# EAGLE design beagle_cnc_1.0 (EAGLE 7.3.0)
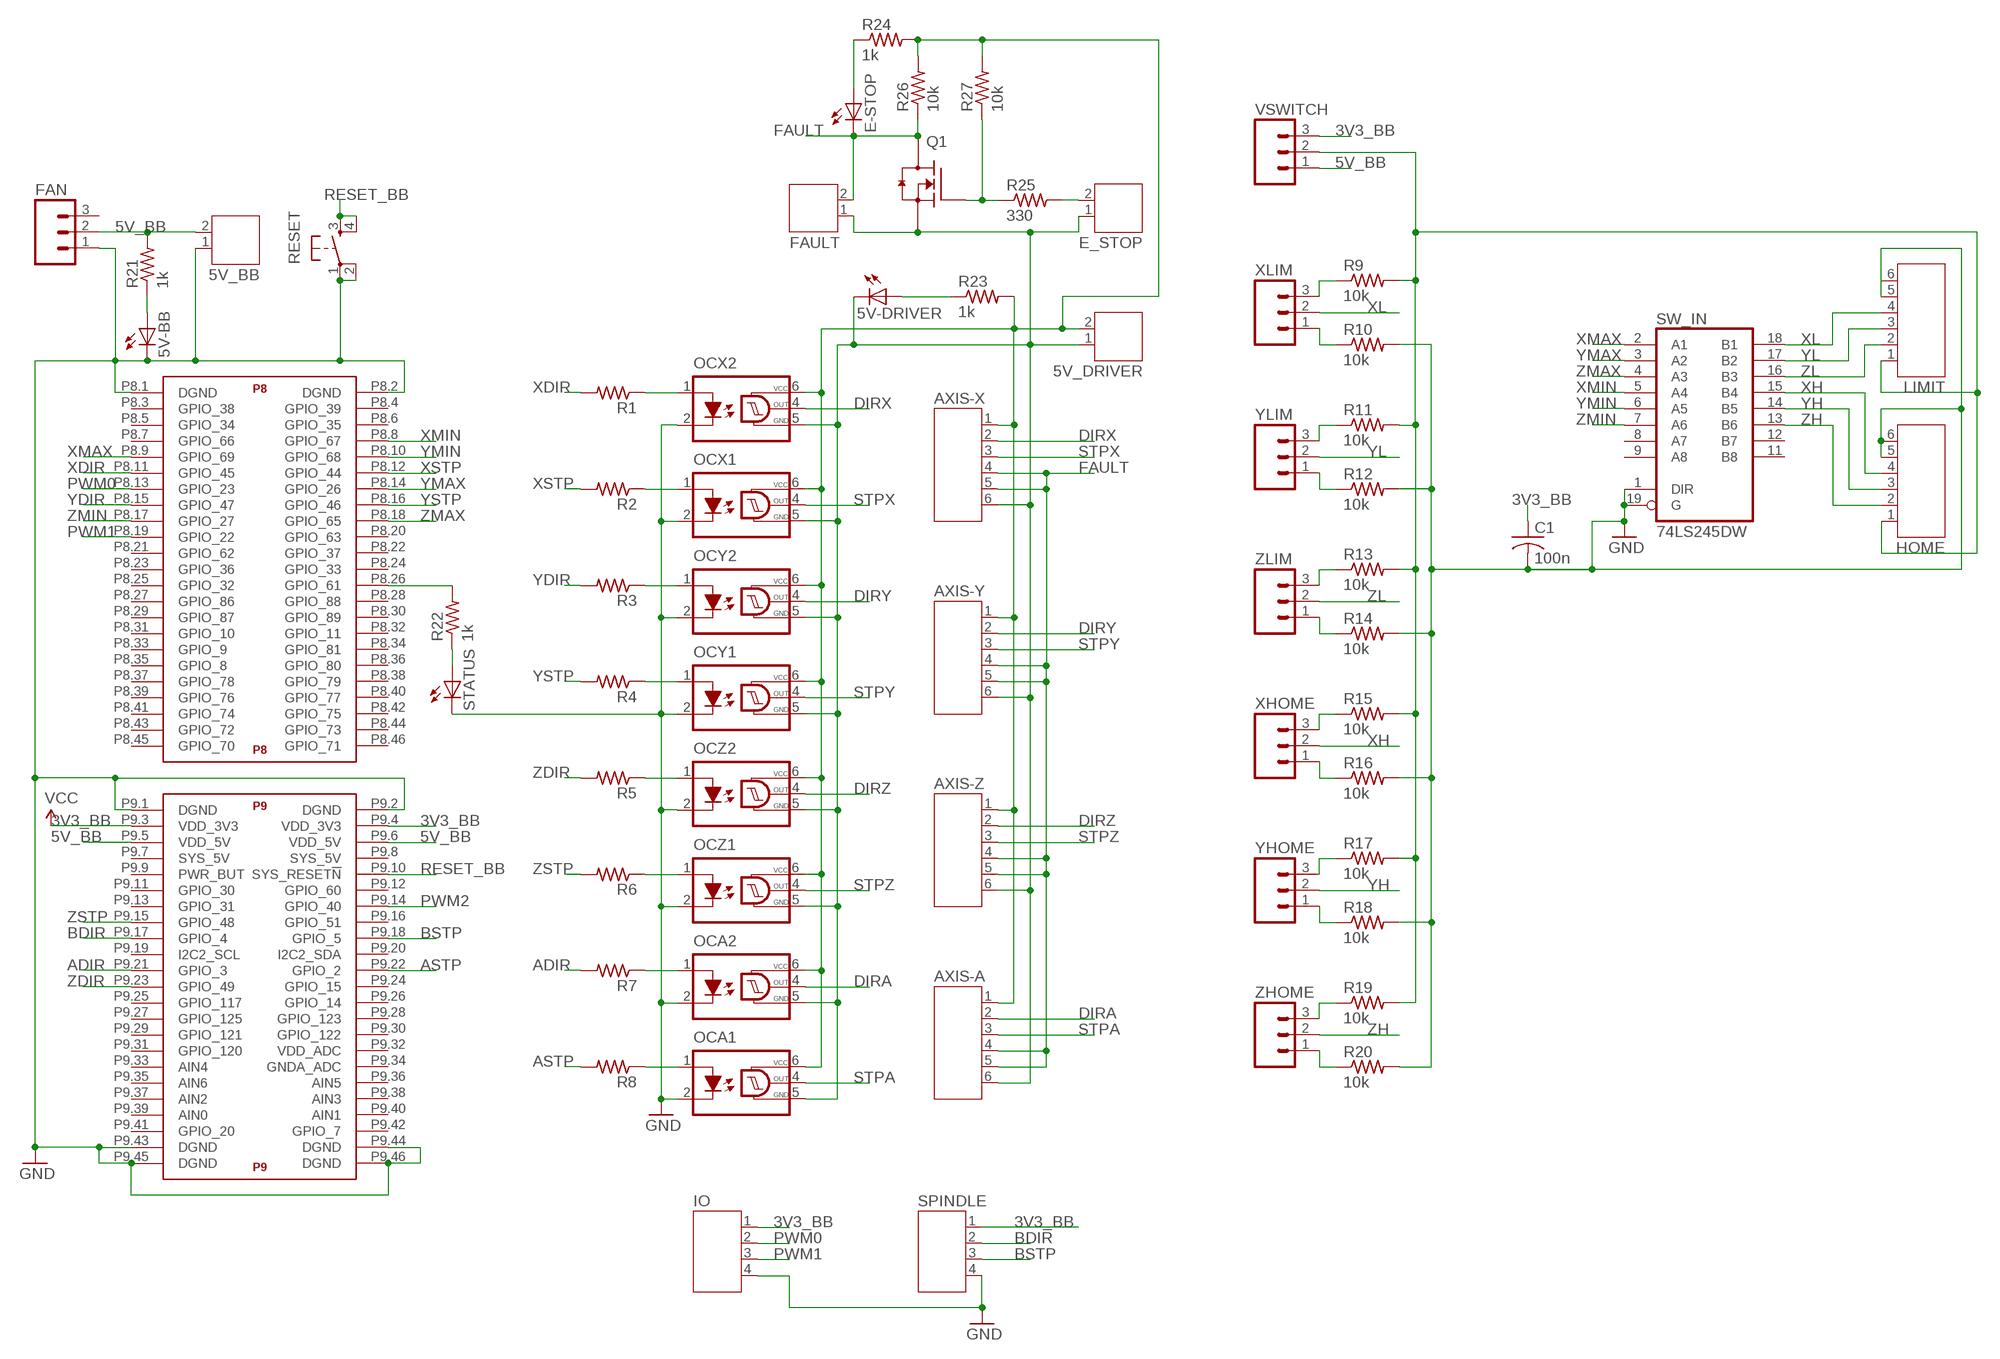
[diagram p0: schematic, sheet 1]

## Parts
5V-BB  LEDCHIP-LED0603  [CHIP-LED0603]
5V-DRIVER  LEDCHIP-LED0603  [CHIP-LED0603]
5V_BB  JST-PH2  [JST-PH2]
5V_DRIVER  JST-PH2  [JST-PH2]
AXIS-A  JST-PH6  [JST-PH6]
AXIS-X  JST-PH6  [JST-PH6]
AXIS-Y  JST-PH6  [JST-PH6]
AXIS-Z  JST-PH6  [JST-PH6]
C1  100n  C-USC0603  [C0603]
E-STOP  LEDCHIP-LED0603  [CHIP-LED0603]
E_STOP  JST-PH2  [JST-PH2]
FAN  M03POLAR  [MOLEX-1X3]
FAULT  JST-PH2  [JST-PH2]
HOME  JST-PH6  [JST-PH6]
IO  JST-PH4  [JST-PH4]
LIMIT  JST-PH6  [JST-PH6]
OCA1  H11L1MS  [DIL6-SMD]
OCA2  H11L1MS  [DIL6-SMD]
OCX1  H11L1MS  [DIL6-SMD]
OCX2  H11L1MS  [DIL6-SMD]
OCY1  H11L1MS  [DIL6-SMD]
OCY2  H11L1MS  [DIL6-SMD]
OCZ1  H11L1MS  [DIL6-SMD]
OCZ2  H11L1MS  [DIL6-SMD]
Q1  MOSFET-NCH_SOT-23  [SOT95P280X135-3N]
R1  R-US_R0603  [R0603]
R2  R-US_R0603  [R0603]
R3  R-US_R0603  [R0603]
R4  R-US_R0603  [R0603]
R5  R-US_R0603  [R0603]
R6  R-US_R0603  [R0603]
R7  R-US_R0603  [R0603]
R8  R-US_R0603  [R0603]
R9  10k  R-US_R0603  [R0603]
R10  10k  R-US_R0603  [R0603]
R11  10k  R-US_R0603  [R0603]
R12  10k  R-US_R0603  [R0603]
R13  10k  R-US_R0603  [R0603]
R14  10k  R-US_R0603  [R0603]
R15  10k  R-US_R0603  [R0603]
R16  10k  R-US_R0603  [R0603]
R17  10k  R-US_R0603  [R0603]
R18  10k  R-US_R0603  [R0603]
R19  10k  R-US_R0603  [R0603]
R20  10k  R-US_R0603  [R0603]
R21  1k  R-US_R0603  [R0603]
R22  1k  R-US_R0603  [R0603]
R23  1k  R-US_R0603  [R0603]
R24  1k  R-US_R0603  [R0603]
R25  330  R-US_R0603  [R0603]
R26  10k  R-US_R0603  [R0603]
R27  10k  R-US_R0603  [R0603]
RESET  TAC_SWITCHSMD  [TACTILE-SWITCH-SMD]
SPINDLE  JST-PH4  [JST-PH4]
STATUS  LEDCHIP-LED0603  [CHIP-LED0603]
SW_IN  74LS245DW  [SO20W]
U$1  BEAGLE_BONE_BLACK_CAPE  [BEAGLE_BONE_BLACK_CAPE]
VSWITCH  M03PTH  [1X03]
XHOME  M03PTH  [1X03]
XLIM  M03PTH  [1X03]
YHOME  M03PTH  [1X03]
YLIM  M03PTH  [1X03]
ZHOME  M03PTH  [1X03]
ZLIM  M03PTH  [1X03]

## Nets
3V3_BB: C1.1 IO.1 SPINDLE.1 U$1.P9.3(P9:VDD_3V3) U$1.P9.4(P9:VDD_3V3) VSWITCH.3 ; supply symbol labelled VCC
5V_BB: 5V_BB.2 FAN.2 R21.2 U$1.P9.5(P9:VDD_5V) U$1.P9.6(P9:VDD_5V) VSWITCH.1
ADIR: R7.2 U$1.P9.21(P9:GPIO_3)
ASTP: R8.2 U$1.P9.22(P9:GPIO_2)
AXISGND: 5V-DRIVER.C 5V_DRIVER.1 AXIS-A.6 AXIS-X.6 AXIS-Y.6 AXIS-Z.6 E_STOP.1 FAULT.1 OCA1.5(GND) OCA2.5(GND) OCX1.5(GND) OCX2.5(GND) OCY1.5(GND) OCY2.5(GND) OCZ1.5(GND) OCZ2.5(GND) Q1.2(S)
BDIR: SPINDLE.2 U$1.P9.17(P9:GPIO_4)
BLABLA: HOME.1 LIMIT.1 R9.2 R11.2 R13.2 R15.2 R17.2 R19.2 VSWITCH.2
BSTP: SPINDLE.3 U$1.P9.18(P9:GPIO_5)
DIRA: AXIS-A.2 OCA2.4(OUT)
DIRX: AXIS-X.2 OCX2.4(OUT)
DIRY: AXIS-Y.2 OCY2.4(OUT)
DIRZ: AXIS-Z.2 OCZ2.4(OUT)
FAULT: AXIS-A.4 AXIS-A.5 AXIS-X.4 AXIS-X.5 AXIS-Y.4 AXIS-Y.5 AXIS-Z.4 AXIS-Z.5 E-STOP.C FAULT.2 Q1.3(D) R26.1
GND: 5V-BB.C 5V_BB.1 C1.2 FAN.1 HOME.5 HOME.6 IO.4 LIMIT.5 LIMIT.6 OCA1.2(C) OCA2.2(C) OCX1.2(C) OCX2.2(C) OCY1.2(C) OCY2.2(C) OCZ1.2(C) OCZ2.2(C) R10.2 R12.2 R14.2 R16.2 R18.2 R20.2 RESET.1 RESET.2 SPINDLE.4 STATUS.C SW_IN.1(DIR) SW_IN.19(G) U$1.P8.1(P8:DGND) U$1.P8.2(P8:DGND) U$1.P9.1(P9:DGND) U$1.P9.2(P9:DGND) U$1.P9.43(P9:DGND) U$1.P9.44(P9:DGND) U$1.P9.45(P9:DGND) U$1.P9.46(P9:DGND)
N$1: 5V-BB.A R21.1
N$2: OCA1.1(A) R8.1
N$3: 5V-DRIVER.A R23.1
N$4: R22.1 STATUS.A
N$6: OCA2.1(A) R7.1
N$8: OCZ1.1(A) R6.1
N$9: R9.1 XLIM.3
N$10: OCZ2.1(A) R5.1
N$11: E-STOP.A R24.1
N$12: OCY1.1(A) R4.1
N$14: OCY2.1(A) R3.1
N$16: OCX1.1(A) R2.1
N$17: OCX2.1(A) R1.1
N$18: R10.1 XLIM.1
N$19: R11.1 YLIM.3
N$24: R12.1 YLIM.1
N$25: R13.1 ZLIM.3
N$26: R14.1 ZLIM.1
N$27: R15.1 XHOME.3
N$28: R16.1 XHOME.1
N$29: R17.1 YHOME.3
N$30: R18.1 YHOME.1
N$31: R19.1 ZHOME.3
N$32: R20.1 ZHOME.1
N$33: Q1.1(G) R25.1 R27.1
N$34: E_STOP.2 R25.2
N$37: 5V_DRIVER.2 AXIS-A.1 AXIS-X.1 AXIS-Y.1 AXIS-Z.1 OCA1.6(VCC) OCA2.6(VCC) OCX1.6(VCC) OCX2.6(VCC) OCY1.6(VCC) OCY2.6(VCC) OCZ1.6(VCC) OCZ2.6(VCC) R23.2 R24.2 R26.2 R27.2
PWM0: IO.2 U$1.P8.13(P8:GPIO_23)
PWM1: IO.3 U$1.P8.19(P8:GPIO_22)
PWM2: U$1.P9.14(P9:GPIO_40)
RESET_BB: RESET.3 RESET.4 U$1.P9.10(P9:SYS_RESET!N)
STATUS: R22.2 U$1.P8.26(P8:GPIO_61)
STPA: AXIS-A.3 OCA1.4(OUT)
STPX: AXIS-X.3 OCX1.4(OUT)
STPY: AXIS-Y.3 OCY1.4(OUT)
STPZ: AXIS-Z.3 OCZ1.4(OUT)
XDIR: R1.2 U$1.P8.11(P8:GPIO_45)
XH: HOME.4 SW_IN.15(B4) XHOME.2
XL: LIMIT.4 SW_IN.18(B1) XLIM.2
XMAX: SW_IN.2(A1) U$1.P8.9(P8:GPIO_69)
XMIN: SW_IN.5(A4) U$1.P8.8(P8:GPIO_67)
XSTP: R2.2 U$1.P8.12(P8:GPIO_44)
YDIR: R3.2 U$1.P8.15(P8:GPIO_47)
YH: HOME.3 SW_IN.14(B5) YHOME.2
YL: LIMIT.3 SW_IN.17(B2) YLIM.2
YMAX: SW_IN.3(A2) U$1.P8.14(P8:GPIO_26)
YMIN: SW_IN.6(A5) U$1.P8.10(P8:GPIO_68)
YSTP: R4.2 U$1.P8.16(P8:GPIO_46)
ZDIR: R5.2 U$1.P9.23(P9:GPIO_49)
ZH: HOME.2 SW_IN.13(B6) ZHOME.2
ZL: LIMIT.2 SW_IN.16(B3) ZLIM.2
ZMAX: SW_IN.4(A3) U$1.P8.18(P8:GPIO_65)
ZMIN: SW_IN.7(A6) U$1.P8.17(P8:GPIO_27)
ZSTP: R6.2 U$1.P9.15(P9:GPIO_48)
Unconnected: FAN.3 SW_IN.8(A7) SW_IN.9(A8) SW_IN.11(B8) SW_IN.12(B7) U$1.P8.3(P8:GPIO_38) U$1.P8.4(P8:GPIO_39) U$1.P8.5(P8:GPIO_34) U$1.P8.6(P8:GPIO_35) U$1.P8.7(P8:GPIO_66) U$1.P8.20(P8:GPIO_63) U$1.P8.21(P8:GPIO_62) U$1.P8.22(P8:GPIO_37) U$1.P8.23(P8:GPIO_36) U$1.P8.24(P8:GPIO_33) U$1.P8.25(P8:GPIO_32) U$1.P8.27(P8:GPIO_86) U$1.P8.28(P8:GPIO_88) U$1.P8.29(P8:GPIO_87) U$1.P8.30(P8:GPIO_89) U$1.P8.31(P8:GPIO_10) U$1.P8.32(P8:GPIO_11) U$1.P8.33(P8:GPIO_9) U$1.P8.34(P8:GPIO_81) U$1.P8.35(P8:GPIO_8) U$1.P8.36(P8:GPIO_80) U$1.P8.37(P8:GPIO_78) U$1.P8.38(P8:GPIO_79) U$1.P8.39(P8:GPIO_76) U$1.P8.40(P8:GPIO_77) U$1.P8.41(P8:GPIO_74) U$1.P8.42(P8:GPIO_75) U$1.P8.43(P8:GPIO_72) U$1.P8.44(P8:GPIO_73) U$1.P8.45(P8:GPIO_70) U$1.P8.46(P8:GPIO_71) U$1.P9.7(P9:SYS_5V) U$1.P9.8(P9:SYS_5V) U$1.P9.9(P9:PWR_BUT) U$1.P9.11(P9:GPIO_30) U$1.P9.12(P9:GPIO_60) U$1.P9.13(P9:GPIO_31) U$1.P9.16(P9:GPIO_51) U$1.P9.19(P9:I2C2_SCL) U$1.P9.20(P9:I2C2_SDA) U$1.P9.24(P9:GPIO_15) U$1.P9.25(P9:GPIO_117) U$1.P9.26(P9:GPIO_14) U$1.P9.27(P9:GPIO_125) U$1.P9.28(P9:GPIO_123) U$1.P9.29(P9:GPIO_121) U$1.P9.30(P9:GPIO_122) U$1.P9.31(P9:GPIO_120) U$1.P9.32(P9:VDD_ADC) U$1.P9.33(P9:AIN4) U$1.P9.34(P9:GNDA_ADC) U$1.P9.35(P9:AIN6) U$1.P9.36(P9:AIN5) U$1.P9.37(P9:AIN2) U$1.P9.38(P9:AIN3) U$1.P9.39(P9:AIN0) U$1.P9.40(P9:AIN1) U$1.P9.41(P9:GPIO_20) U$1.P9.42(P9:GPIO_7)

## Power pins joined to a net without a drawn wire
3V3_BB: SW_IN.20(VCC)
GND: SW_IN.10(GND)

## Library data of the parts
5V-BB 5V-DRIVER E-STOP STATUS = adafruit:LED: LED OSRAM: - CHIPLED LG R971, LG N971, LY N971, LG Q971, LY Q971, LO R971, LY R971 LH N974, LH R974 LS Q976, LO Q976, LY Q976 LO Q996 - Hyper CHIPLED LW Q18S LB Q993, LB Q99A, LB R99A - SideLED LS A670, LO A670, LY A670, LG A670, LP A670 LB A673, LV A673, LT A673, LW A673 LH A674 LY A675 LS A676, LA A676, LO A676, LY A676, LW A676 LS A679, LY A679, LG A679 - Hyper Micro SIDELED® LS Y876, LA Y876, LO Y876, LY Y876 LT Y87S - SmartLED LW L88C, LW L88S LB L89C, LB L89S, LG L890 LS L89K, LO L89K, LY L89K LS L896, LA L896, LO L896, LY L896 - TOPLED LS T670, LO T670, LY T670, LG T670, LP T670 LSG T670, LSP T670, LSY T670, LOP T670, LYG T670 LG T671, LOG T671, LSG T671 LB T673, LV T673, LT T673, LW T673 LH T674 LS T676, LA T676, LO T676, LY T676, LB T676, LH T676, LSB T676, LW T676 LB T67C, LV T67C, LT T67C, LS T67K, LO T67K, LY T67K, LW E67C LS E67B, LA E67B, LO E67B, LY E67B, LB E67C, LV E67C, LT E67C LW T67C LS T679, LY T679, LG T679 LS T770, LO T770, LY T770, LG T770, LP T770 LB T773, LV T773, LT T773, LW T773 LH T774 LS E675, LA E675, LY E675, LS T675 LS T776, LA T776, LO T776, LY T776, LB T776 LHGB T686 LT T68C, LB T68C - Hyper Mini TOPLED® LB M676 - Mini TOPLED Santana® LG M470 LS M47K, LO M47K, LY M47K Source: http://www.osram.convergy.de/
5V_BB 5V_DRIVER E_STOP FAULT = jst-ph:JST-PH2
AXIS-A AXIS-X AXIS-Y AXIS-Z HOME LIMIT = jst-ph:JST-PH6
C1 = adafruit:C-US: CAPACITOR, American symbol
FAN VSWITCH XHOME XLIM YHOME YLIM ZHOME ZLIM = SparkFun-Connectors:M03: Header 3 Standard 3-pin 0.1" header. Use with straight break away headers (SKU : PRT-00116), right angle break away headers (PRT-00553), swiss pins (PRT-00743), machine pins (PRT-00117), and female headers (PRT-00115). Molex polarized connector foot print use with SKU : PRT-08232 with associated crimp pins and housings.
IO SPINDLE = jst-ph:JST-PH4
OCA1 OCA2 OCX1 OCX2 OCY1 OCY2 OCZ1 OCZ2 = optocoupler:H11L*M: 6-Pin DIP Optocoupler Source: http://www.fairchildsemi.com/ds/H1/H11L2-M.pdf; OC_FARNELL: unknown; OC_NEWARK: unknown
Q1 = ipc-7351-transistor:MOSFET-NCH_
R1-R27 = adafruit:R-US_: RESISTOR, American symbol
RESET = SparkFun-Electromechanical:TAC_SWITCH: Momentary Switch Button commonly used for reset or general input. Spark Fun Electronics SKU : COM-00097 SMT- SWCH-08247; PROD_ID: SWCH-08247
SW_IN = adafruit:74*245: Octal BUS TRANSCEIVER, 3-state
U$1 = SparkFun-Boards:BEAGLE_BONE_BLACK_CAPE

## Board
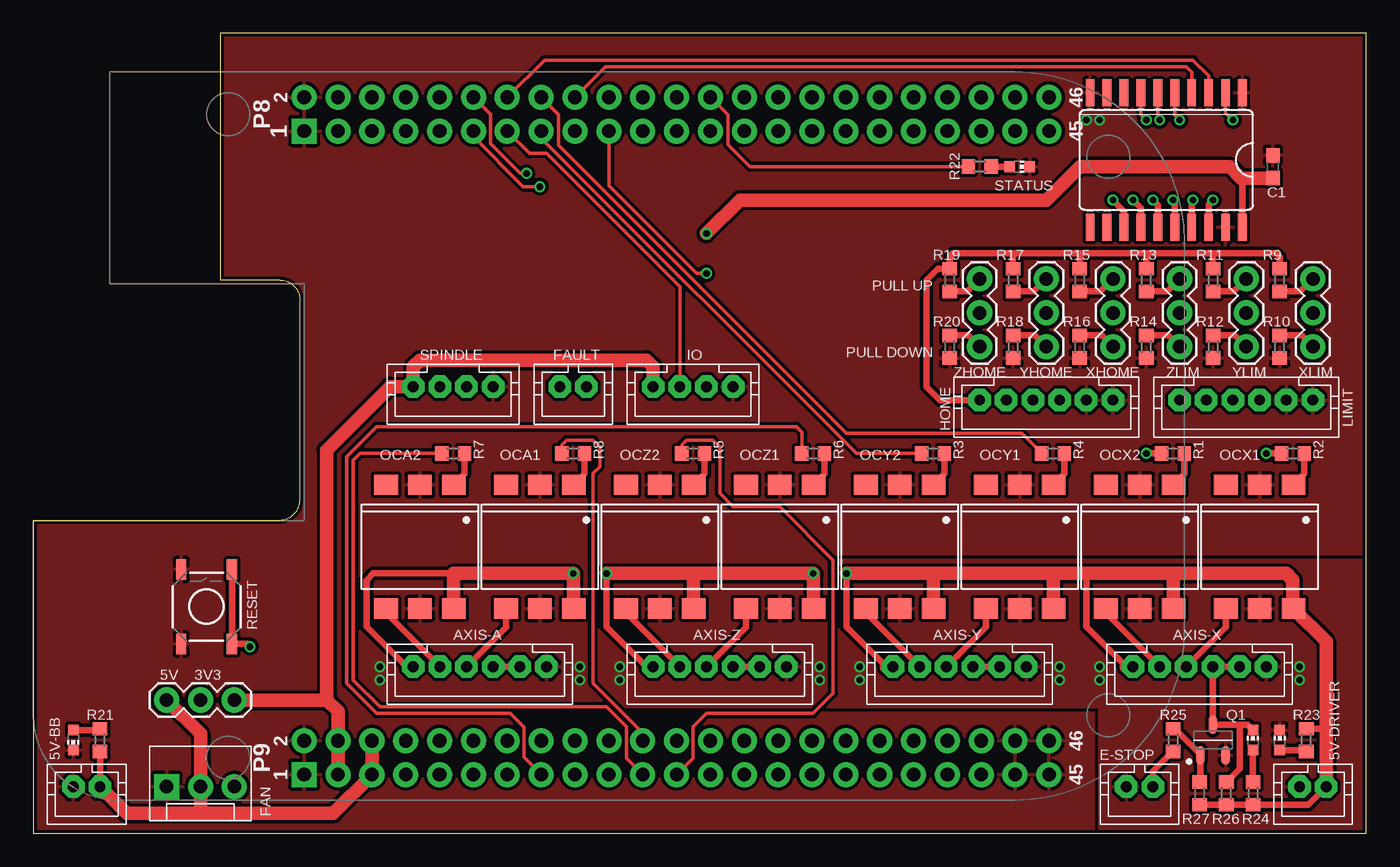
[diagram p1: board, top side]
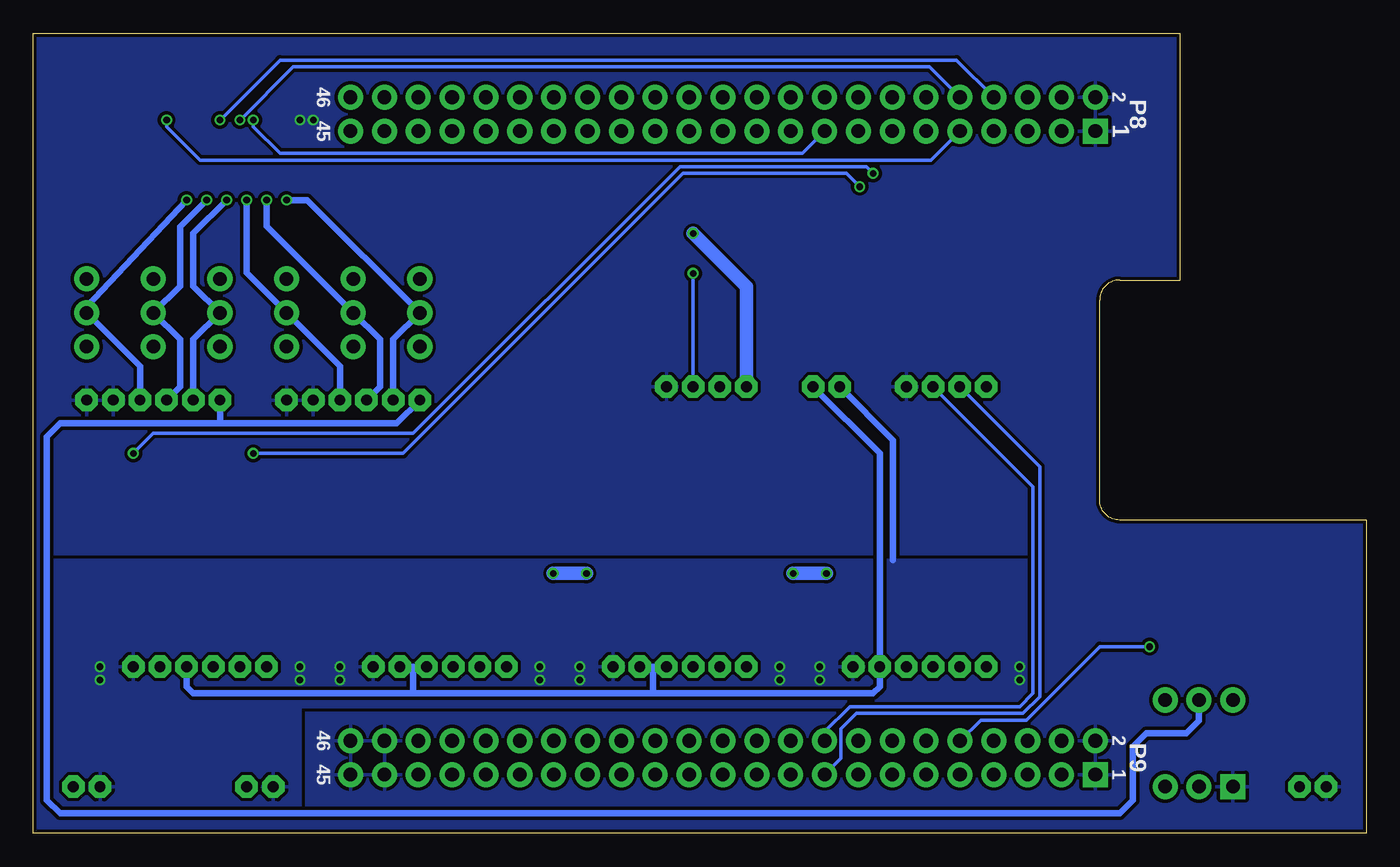
[diagram p2: board, bottom side, seen from below]

Size 100 x 60 mm. Coordinates in mm from the lower left corner, seen from the top.
Outline: 0,0 100,0 100,60 14,60 14,41.5 18.5,41.5 arc-90 20,40 20,25 arc-90 18.5,23.5 0,23.5 0,0
Copper layers (1*16): Top 0.035mm / dielectric 1.5mm / Bottom 0.035mm
Design rules "ITEADstudio_DRC": minimum track width 6mil, minimum drill 12mil, track to track 6mil, track to pad 6mil, pad to pad 6mil, via to via 6mil, smd to smd 0mil, copper to edge 10mil, drill to drill 10mil, minimum pad ring 10mil, minimum via ring 6mil, stop-mask expansion 2mil, vias tented up to drill 100mil, thermal gap 10mil

### Footprints (pad centres in the part's own frame; a part is rotated, then mirrored left to right if it is on the bottom)
CHIP-LED0603 = smd 0.8 x 0.8: A 0,-0.75; C 0,0.75
JST-PH2 = drill 0.813 pad 1.676 octagon: 1 1,0; 2 -1,0
JST-PH6 = drill 0.813 pad 1.676 octagon: 1 5,0; 2 3,0; 3 1,0; 4 -1,0; 5 -3,0; 6 -5,0
C0603 = smd 1.1 x 1: 1 -0.85,0; 2 0.85,0
MOLEX-1X3 = drill 1.016 pad 1.88 square: 1 0,0 | drill 1.016 pad 1.88: 2 2.54,0; 3 5.08,0
JST-PH4 = drill 0.813 pad 1.676 octagon: 1 3,0; 2 1,0; 3 -1,0; 4 -3,0
DIL6-SMD = smd 1.78 x 1.52: 1 -2.54,-4.645; 2 0,-4.645; 3 2.54,-4.645; 4 2.54,4.645; 5 0,4.645; 6 -2.54,4.645
SOT95P280X135-3N = smd 1.4 x 0.65: 1 -1.15,0.95; 2 -1.15,-0.95; 3 1.15,0
R0603 = smd 1 x 1.1: 1 -0.85,0; 2 0.85,0
TACTILE-SWITCH-SMD = smd 1.524 x 0.762: 1 -2.794,1.905; 2 2.794,1.905; 3 -2.794,-1.905; 4 2.794,-1.905
SO20W = smd 0.66 x 2.032: 1 -5.715,-5.029; 2 -4.445,-5.029; 3 -3.175,-5.029; 4 -1.905,-5.029; 5 -0.635,-5.029; 6 0.635,-5.029; 7 1.905,-5.029; 8 3.175,-5.029; 9 4.445,-5.029; 10 5.715,-5.029; 11 5.715,5.029; 12 4.445,5.029; 13 3.175,5.029; 14 1.905,5.029; 15 0.635,5.029; 16 -0.635,5.029; 17 -1.905,5.029; 18 -3.175,5.029; 19 -4.445,5.029; 20 -5.715,5.029
BEAGLE_BONE_BLACK_CAPE = drill 1.016 pad 1.88 square: P8.1 20.32,50.165; P9.1 20.32,1.905 | drill 1.016 pad 1.88: P8.2 20.32,52.705; P8.3 22.86,50.165; P8.4 22.86,52.705; P8.5 25.4,50.165; P8.6 25.4,52.705; P8.7 27.94,50.165; P8.8 27.94,52.705; P8.9 30.48,50.165; P8.10 30.48,52.705; P8.11 33.02,50.165; P8.12 33.02,52.705; P8.13 35.56,50.165; P8.14 35.56,52.705; P8.15 38.1,50.165; P8.16 38.1,52.705; P8.17 40.64,50.165; P8.18 40.64,52.705; P8.19 43.18,50.165; P8.20 43.18,52.705; P8.21 45.72,50.165; P8.22 45.72,52.705; P8.23 48.26,50.165; P8.24 48.26,52.705; P8.25 50.8,50.165; P8.26 50.8,52.705; P8.27 53.34,50.165; P8.28 53.34,52.705; P8.29 55.88,50.165; P8.30 55.88,52.705; P8.31 58.42,50.165; P8.32 58.42,52.705; P8.33 60.96,50.165; P8.34 60.96,52.705; P8.35 63.5,50.165; P8.36 63.5,52.705; P8.37 66.04,50.165; P8.38 66.04,52.705; P8.39 68.58,50.165; P8.40 68.58,52.705; P8.41 71.12,50.165; P8.42 71.12,52.705; P8.43 73.66,50.165; P8.44 73.66,52.705; P8.45 76.2,50.165; P8.46 76.2,52.705; P9.2 20.32,4.445; P9.3 22.86,1.905; P9.4 22.86,4.445; P9.5 25.4,1.905; P9.6 25.4,4.445; P9.7 27.94,1.905; P9.8 27.94,4.445; P9.9 30.48,1.905; P9.10 30.48,4.445; P9.11 33.02,1.905; P9.12 33.02,4.445; P9.13 35.56,1.905; P9.14 35.56,4.445; P9.15 38.1,1.905; P9.16 38.1,4.445; P9.17 40.64,1.905; P9.18 40.64,4.445; P9.19 43.18,1.905; P9.20 43.18,4.445; P9.21 45.72,1.905; P9.22 45.72,4.445; P9.23 48.26,1.905; P9.24 48.26,4.445; P9.25 50.8,1.905; P9.26 50.8,4.445; P9.27 53.34,1.905; P9.28 53.34,4.445; P9.29 55.88,1.905; P9.30 55.88,4.445; P9.31 58.42,1.905; P9.32 58.42,4.445; P9.33 60.96,1.905; P9.34 60.96,4.445; P9.35 63.5,1.905; P9.36 63.5,4.445; P9.37 66.04,1.905; P9.38 66.04,4.445; P9.39 68.58,1.905; P9.40 68.58,4.445; P9.41 71.12,1.905; P9.42 71.12,4.445; P9.43 73.66,1.905; P9.44 73.66,4.445; P9.45 76.2,1.905; P9.46 76.2,4.445
1X03 = drill 1.016 pad 1.88: 1 0,0; 2 2.54,0; 3 5.08,0

### Placement (x,y rotation side)
5V-BB  3,7 180 top
5V-DRIVER  93.5,7 0 top
5V_BB  4,3.5 180 top
5V_DRIVER  96,3.5 180 top
AXIS-A  33.5,12.5 180 top
AXIS-X  87.5,12.5 180 top
AXIS-Y  69.5,12.5 180 top
AXIS-Z  51.5,12.5 180 top
C1  93,50 90 top
E-STOP  91.5,7 0 top
E_STOP  83,3.5 180 top
FAN  10,3.5 0 top
FAULT  40.5,33.5 180 top
HOME  76,32.5 180 top
IO  49.5,33.5 180 top
LIMIT  91,32.5 180 top
OCA1  38,21.5 180 top
OCA2  29,21.5 180 top
OCX1  92,21.5 180 top
OCX2  83,21.5 180 top
OCY1  74,21.5 180 top
OCY2  65,21.5 180 top
OCZ1  56,21.5 180 top
OCZ2  47,21.5 180 top
Q1  88.5,7 90 top
R1  85.5,28.5 180 top
R2  94.5,28.5 180 top
R3  67.5,28.5 180 top
R4  76.5,28.5 180 top
R5  49.5,28.5 180 top
R6  58.5,28.5 180 top
R7  31.5,28.5 180 top
R8  40.5,28.5 180 top
R9  93.5,41.5 90 top
R10  93.5,36.5 270 top
R11  88.5,41.5 90 top
R12  88.5,36.5 270 top
R13  83.5,41.5 90 top
R14  83.5,36.5 270 top
R15  78.5,41.5 90 top
R16  78.5,36.5 270 top
R17  73.5,41.5 90 top
R18  73.5,36.5 270 top
R19  68.75,41.5 90 top
R20  68.75,36.5 270 top
R21  5,7 270 top
R22  71,50 180 top
R23  95.5,7 90 top
R24  91.5,3 270 top
R25  85.5,7 270 top
R26  89.5,3 270 top
R27  87.5,3 270 top
RESET  13,17 90 top
SPINDLE  31.5,33.5 180 top
STATUS  74,50 270 top
SW_IN  85,50.5 180 top
U$1  0,2.5 0 top
VSWITCH  10,10 0 top
XHOME  81,36.5 90 top
XLIM  96,36.5 90 top
YHOME  76,36.5 90 top
YLIM  91,36.5 90 top
ZHOME  71,36.5 90 top
ZLIM  86,36.5 90 top

### Tracks (layer width: path | path; a pad name or v marks a point on that pad's centre or on a via)
3V3_BB  (via drill 0.5)
  Top 0.5: SW_IN.20 90.72,48.94 90.75,49.15 | 31.54,35.5 32,35.5
  Top 1: U$1.P9.3 U$1.P9.4 22.86,9.14 22,10 | VSWITCH.3 22,10 | v50.5,45 53,47.5 76,47.5 78.5,50 89.75,50 90.6,49.15 90.75,49.15 C1.1 | 22,10 22,28.75 26.75,33.5 SPINDLE.1 28.5,35 29,35.5 32,35.5 46,35.5 46.5,35 IO.1
  Bottom 1: IO.1 46.5,41 v50.5,45
5V_BB
  Top 0.5: 5V_BB.2 R21.2
  Top 1: U$1.P9.6 U$1.P9.5 22.5,1.5 12.54,1.5 | 5V_BB.2 7,1.5 12.54,1.5 | 12.54,1.5 FAN.2 12.54,7.46 VSWITCH.1
  Bottom 0.5: U$1.P9.5
ADIR
  Top 0.25: R7.2 24.5,28.5 24,28 24,11.5 26,9.5 43,9.5 44.5,8 44.5,5.62 U$1.P9.21
ASTP
  Top 0.25: U$1.P9.22 45.72,7.53 42,11.25 42,27 42.5,27.5 42.5,29 42,29.5 40,29.5 39.65,29.15 R8.2
AXISGND  (via drill 0.5)
  Bottom 0.5: FAULT.1 35.5,29.5 35.5,20.5
  other vias: 41,12.5 59,12.5 77,12.5 95,12.5 26,12.5 44,12.5 62,12.5 80,12.5 41,11.5 26,11.5 44,11.5 59,11.5 62,11.5 77,11.5 80,11.5 95,11.5
  pour Bottom (isolate 0.25): 100,0 100,20.5 24.5,20.5 24.5,9.5 80,9.5 80,0
  pour Top (isolate 0.25): 100,0 100,20.5 24.5,20.5 24.5,9.5 80,9.5 80,0
BDIR
  Bottom 0.25: U$1.P9.17 39.4,5.64 39.4,7.85 38.25,9 25.75,9 24.5,10.25 24.5,27.5 SPINDLE.2
BLABLA
  Top 0.5: 73.5,43.5 69,43.5 68.75,43.25 R19.2 67.85,42.35 67,41.5 67,33.5 68,32.5 HOME.1 | 73.5,43.5 78.5,43.5 | 78.5,43.5 83.5,43.5 | 83.5,43.5 88.5,43.5 | 88.5,43.5 93.25,43.5 93.5,43.25 R9.2 | R11.2 88.5,43.5 | R13.2 83.5,43.5 | R15.2 78.5,43.5 | R17.2 73.5,43.5
  Bottom 0.5: HOME.1 72.75,30.75 86,30.75 | VSWITCH.2 12.54,8.46 13.5,7.5 16.5,7.5 17.5,6.5 17.5,2.5 18.5,1.5 98,1.5 99,2.5 99,29.75 98,30.75 86,30.75 | 86,30.75 LIMIT.1
BSTP
  Bottom 0.25: U$1.P9.18 40.64,7.61 38.75,9.5 26,9.5 25,10.5 25,26 SPINDLE.3
DIRA
  Top 0.5: OCA2.4 26.46,16.54 AXIS-A.2
DIRX
  Top 0.5: OCX2.4 80.46,16.54 AXIS-X.2
DIRY
  Top 0.5: OCY2.4 62.46,16.54 AXIS-Y.2
DIRZ
  Top 0.5: OCZ2.4 44.46,16.54 AXIS-Z.2
FAULT
  Top 0.5: AXIS-A.4 AXIS-A.5 | AXIS-Z.4 AXIS-Z.5 | AXIS-Y.4 AXIS-Y.5 | AXIS-X.5 AXIS-X.4 Q1.3 90.5,8.15 | 90.5,8.15 91.1,8.15 E-STOP.C | R26.1 90.5,4.85 90.5,8.15
  Bottom 0.5: 53.5,10.5 37,10.5 36.5,11 AXIS-A.5 36.5,28.5 FAULT.2 | 53.5,10.5 71.5,10.5 | 71.5,10.5 88,10.5 88.5,11 AXIS-X.4 | AXIS-Z.4 53.5,12.5 53.5,10.5 | AXIS-Y.5 71.5,12.5 71.5,10.5
GND  (via drill 0.5)
  other vias: 79,53.5 80,53.5
  pour Top (isolate 0.25, rank 6): 0,0 100,0 100,60 0,60
  pour Bottom (isolate 0.25, rank 6): 0,0 100,0 100,60 0,60
N$1
  Top 0.5: R21.1 4.9,7.75 5V-BB.A
N$2
  Top 0.5: OCA1.1 41.35,26.95 R8.1
N$3
  Top 0.5: R23.1 95.4,6.25 5V-DRIVER.A
N$4
  Top 0.5: STATUS.A R22.1
N$6
  Top 0.5: OCA2.1 32.35,26.95 R7.1
N$8
  Top 0.5: OCZ1.1 59.35,26.95 R6.1
N$9
  Top 0.5: R9.1 95.07,40.65 XLIM.3
N$10
  Top 0.5: OCZ2.1 50.35,26.95 R5.1
N$11
  Top 0.5: R24.1 E-STOP.A
N$12
  Top 0.5: OCY1.1 77.35,26.95 R4.1
N$14
  Top 0.5: OCY2.1 68.35,26.95 R3.1
N$16
  Top 0.5: OCX1.1 95.35,26.95 R2.1
N$17
  Top 0.5: OCX2.1 86.35,26.95 R1.1
N$18
  Top 0.5: R10.1 95.15,37.35 XLIM.1
N$19
  Top 0.5: R11.1 90.07,40.65 YLIM.3
N$24
  Top 0.5: R12.1 90.15,37.35 YLIM.1
N$25
  Top 0.5: R13.1 85.07,40.65 ZLIM.3
N$26
  Top 0.5: R14.1 85.15,37.35 ZLIM.1
N$27
  Top 0.5: R15.1 80.07,40.65 XHOME.3
N$28
  Top 0.5: R16.1 80.15,37.35 XHOME.1
N$29
  Top 0.5: R17.1 75.07,40.65 YHOME.3
N$30
  Top 0.5: R18.1 75.15,37.35 YHOME.1
N$31
  Top 0.5: R19.1 70.07,40.65 ZHOME.3
N$32
  Top 0.5: R20.1 70.15,37.35 ZHOME.1
N$33
  Top 0.5: R27.1 87.55,3.9 Q1.1 87.55,5.95 85.65,7.85 R25.1
N$34
  Top 0.5: E_STOP.2 84,4.65 R25.2
N$37  (via drill 0.5)
  Top 0.5: 5V_DRIVER.2 95.65,2.15 R24.2 R26.2 R27.2 | R23.2 97,7.85 | 82,12.5 79,15.5 79,19.5 | 64,12.5 61,15.5 v61,19.5 | AXIS-Z.1 46,12.5 43,15.5 v43,19.5 | AXIS-A.1 28,12.5 25,15.5 25,19 25.5,19.5 31.54,19.5
  Top 1: 5V_DRIVER.2 97,7.85 97,14.39 OCX1.6 94.5,16.89 94.5,19 94,19.5 85.5,19.5 | OCA2.6 31.54,19.5 v40.5,19.5 40.54,19.46 OCA1.6 | v43,19.5 49.5,19.5 | 49.5,19.5 v58.5,19.5 58.54,19.46 OCZ1.6 | v61,19.5 67.5,19.5 | 67.5,19.5 76.5,19.5 | 76.5,19.5 79,19.5 85.5,19.5 | OCX2.6 85.54,19.46 85.5,19.5 | OCY1.6 76.54,19.46 76.5,19.5 | OCY2.6 67.54,19.46 67.5,19.5 | OCZ2.6 49.54,19.46 49.5,19.5 | AXIS-X.1 82,12.5 | AXIS-Y.1 64,12.5
  Bottom 1: v40.5,19.5 v43,19.5 | v58.5,19.5 v61,19.5
PWM0
  Top 0.25: IO.2 48.5,41 38.5,51 37.23,51 U$1.P8.13
PWM1  (via drill 0.5)
  Top 0.25: U$1.P8.19 43.18,48.57 49.75,42 v50.5,42
  Bottom 0.25: v50.5,42 IO.3
RESET_BB  (via drill 0.5)
  Top 0.5: RESET.4 RESET.3 16.04,14.21 v16.25,14
  Bottom 0.25: U$1.P9.10 28.93,8.5 25.5,8.5 20,14 v16.25,14
STATUS
  Top 0.25: R22.2 53.75,50 52.1,51.65 52.1,53.91 U$1.P8.26
STPA
  Top 0.5: AXIS-A.3 35.46,15.46 OCA1.4
STPX
  Top 0.5: AXIS-X.3 89.46,15.46 OCX1.4
STPY
  Top 0.5: AXIS-Y.3 71.46,15.46 OCY1.4
STPZ
  Top 0.5: AXIS-Z.3 53.46,15.46 OCZ1.4
XDIR  (via drill 0.5)
  Top 0.25: U$1.P8.11 33.02,52.23 36.75,48.5 v38,48.5
  Top 0.5: R1.2 v83.5,28.5
  Bottom 0.25: v83.5,28.5 72.25,28.5 51.25,49.5 39,49.5 v38,48.5
XH  (via drill 0.5)
  Top 0.5: SW_IN.15 84.36,47.13 v84,47.5
  Bottom 0.5: HOME.4 77,35.04 XHOME.2 84,42.04 v84,47.5
XL  (via drill 0.5)
  Top 0.5: v88.5,47.5 88.17,47.17 SW_IN.18
  Bottom 0.5: LIMIT.4 92,35.04 XLIM.2 96,39.5 v88.5,47.5
XMAX  (via drill 0.5)
  Top 0.25: SW_IN.2 89.44,54.05 v90,53.5
  Bottom 0.25: U$1.P8.9 32.65,50.5 87.5,50.5 90,53 v90,53.5
XMIN  (via drill 0.5)
  Top 0.25: SW_IN.5 85.64,53.87 v86,53.5
  Bottom 0.25: U$1.P8.8 30.73,58 81.5,58 v86,53.5
XSTP  (via drill 0.5)
  Top 0.25: v37,49.5 36.5,49.5 34.3,51.7 34.3,53.92 U$1.P8.12
  Top 0.5: v92.5,28.5 R2.2
  Bottom 0.25: v92.5,28.5 91,30 71.5,30 51.5,50 37.5,50 v37,49.5
YDIR
  Top 0.25: U$1.P8.15 38.1,52.15 61.75,28.5 R3.2
YH  (via drill 0.5)
  Top 0.5: SW_IN.14 83.09,46.91 v82.5,47.5
  Bottom 0.5: HOME.3 74,33.5 74,37.04 YHOME.2 82.5,45.54 v82.5,47.5
YL  (via drill 0.5)
  Top 0.5: v87,47.5 86.91,47.41 SW_IN.17
  Bottom 0.5: LIMIT.3 89,33.5 89,37.04 YLIM.2 89,41.04 89,45.5 v87,47.5
YMAX
  Top 0.25: U$1.P8.14 38.35,58 87,58 88.17,56.83 SW_IN.3
YMIN  (via drill 0.5)
  Top 0.25: SW_IN.6 84.36,53.63 v84.5,53.5
  Bottom 0.25: U$1.P8.10 32.77,57.5 80.5,57.5 v84.5,53.5
YSTP
  Top 0.25: U$1.P8.16 39.4,53.91 39.4,51.6 61,30 74.15,30 R4.2
ZDIR
  Top 0.25: U$1.P9.23 49.5,5.64 49.5,8 50.5,9 58.5,9 60,10.5 60,20.5 56,24.5 52.5,24.5 51.5,25.5 51.5,29 51,29.5 49,29.5 48.65,29.15 R5.2
ZH  (via drill 0.5)
  Top 0.5: SW_IN.13 81.83,46.67 v81,47.5
  Bottom 0.5: HOME.2 73,37.04 ZHOME.2 79.46,47.5 v81,47.5
ZL  (via drill 0.5)
  Top 0.5: SW_IN.16 85.64,47.37 v85.5,47.5
  Bottom 0.5: LIMIT.2 88,37.04 ZLIM.2 88,41.04 88,45 v85.5,47.5
ZMAX
  Top 0.25: U$1.P8.18 42.94,57.5 86.5,57.5 86.91,57.09 SW_IN.4
ZMIN  (via drill 0.5)
  Top 0.25: SW_IN.7 83.09,53.91 v83.5,53.5
  Bottom 0.25: U$1.P8.17 42.3,51 81.5,51 83.5,53 v83.5,53.5
ZSTP
  Top 0.25: R6.2 57.65,30.1 57.25,30.5 25.75,30.5 23.5,28.25 23.5,11.25 25.75,9 35.75,9 36.8,7.95 36.8,5.71 U$1.P9.15

### Text on the board
tPlace: PULL UP | PULL DOWN
tNames: 5V 3V3 | FAN